# Altium project СТЖ-1-ПУ-01-00-001 - Плата системы управления.PrjPcb
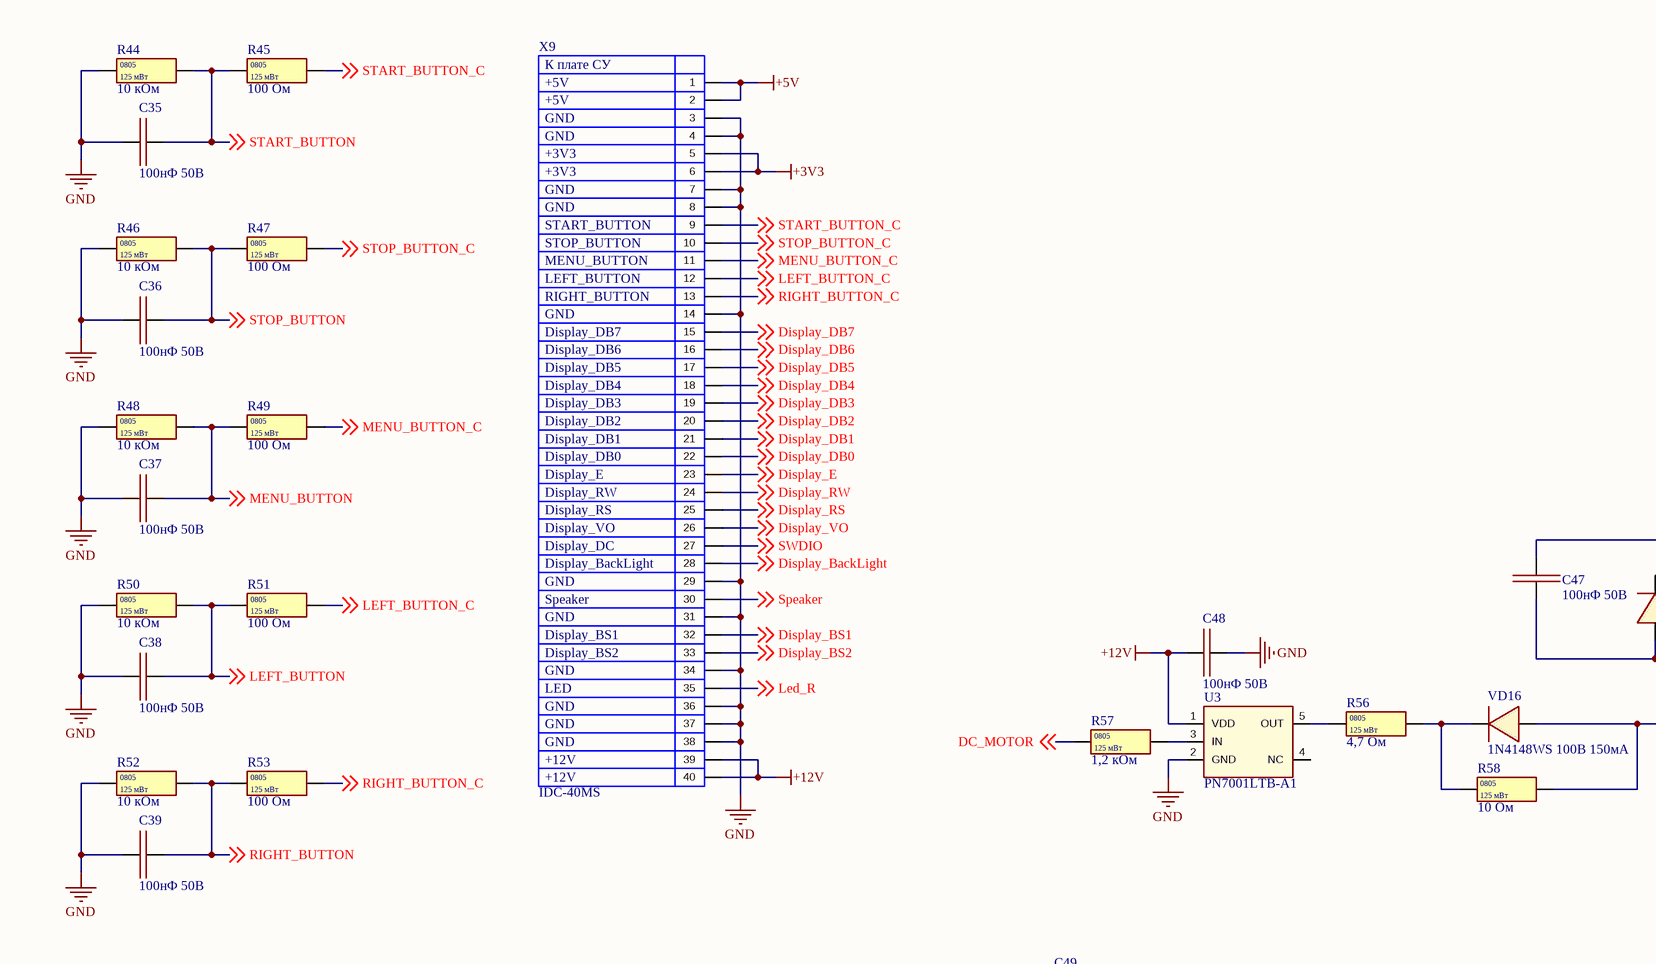
[diagram p0: СТЖ-1-ПУ-01-00-001.SchDoc, top left]
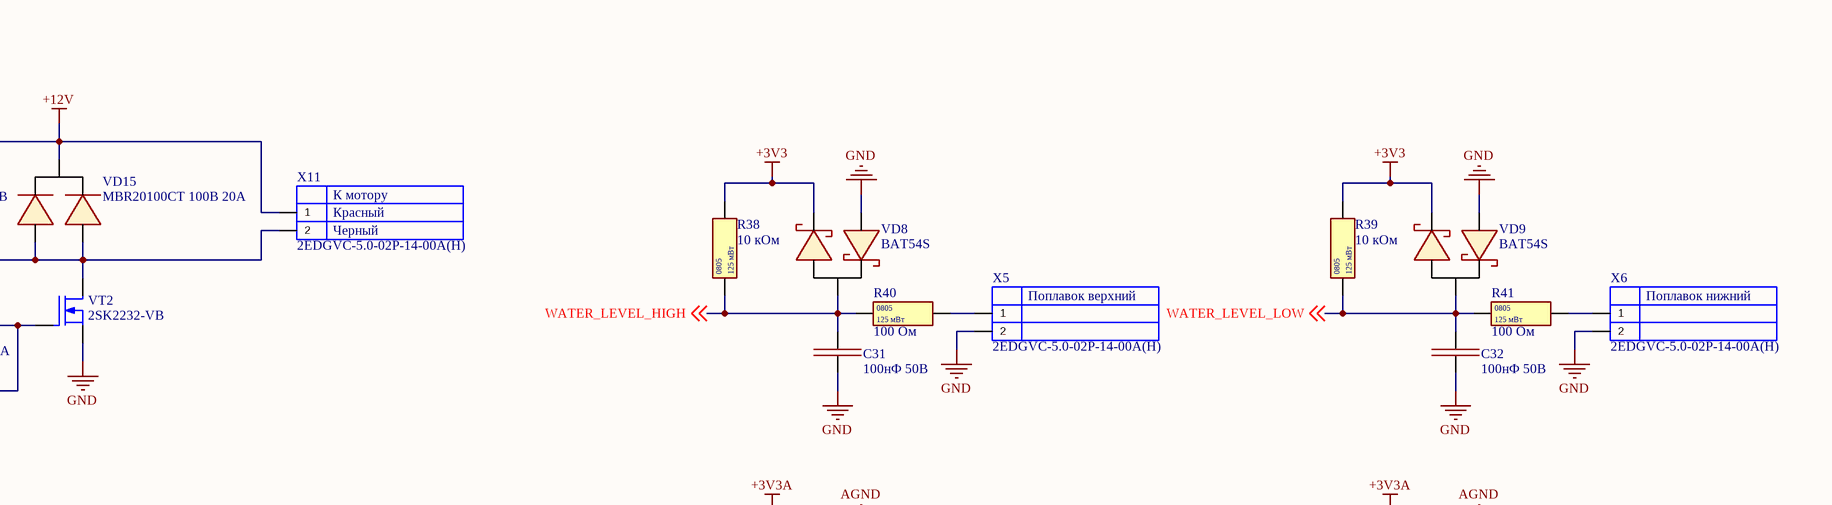
[diagram p1: СТЖ-1-ПУ-01-00-001.SchDoc, top right]
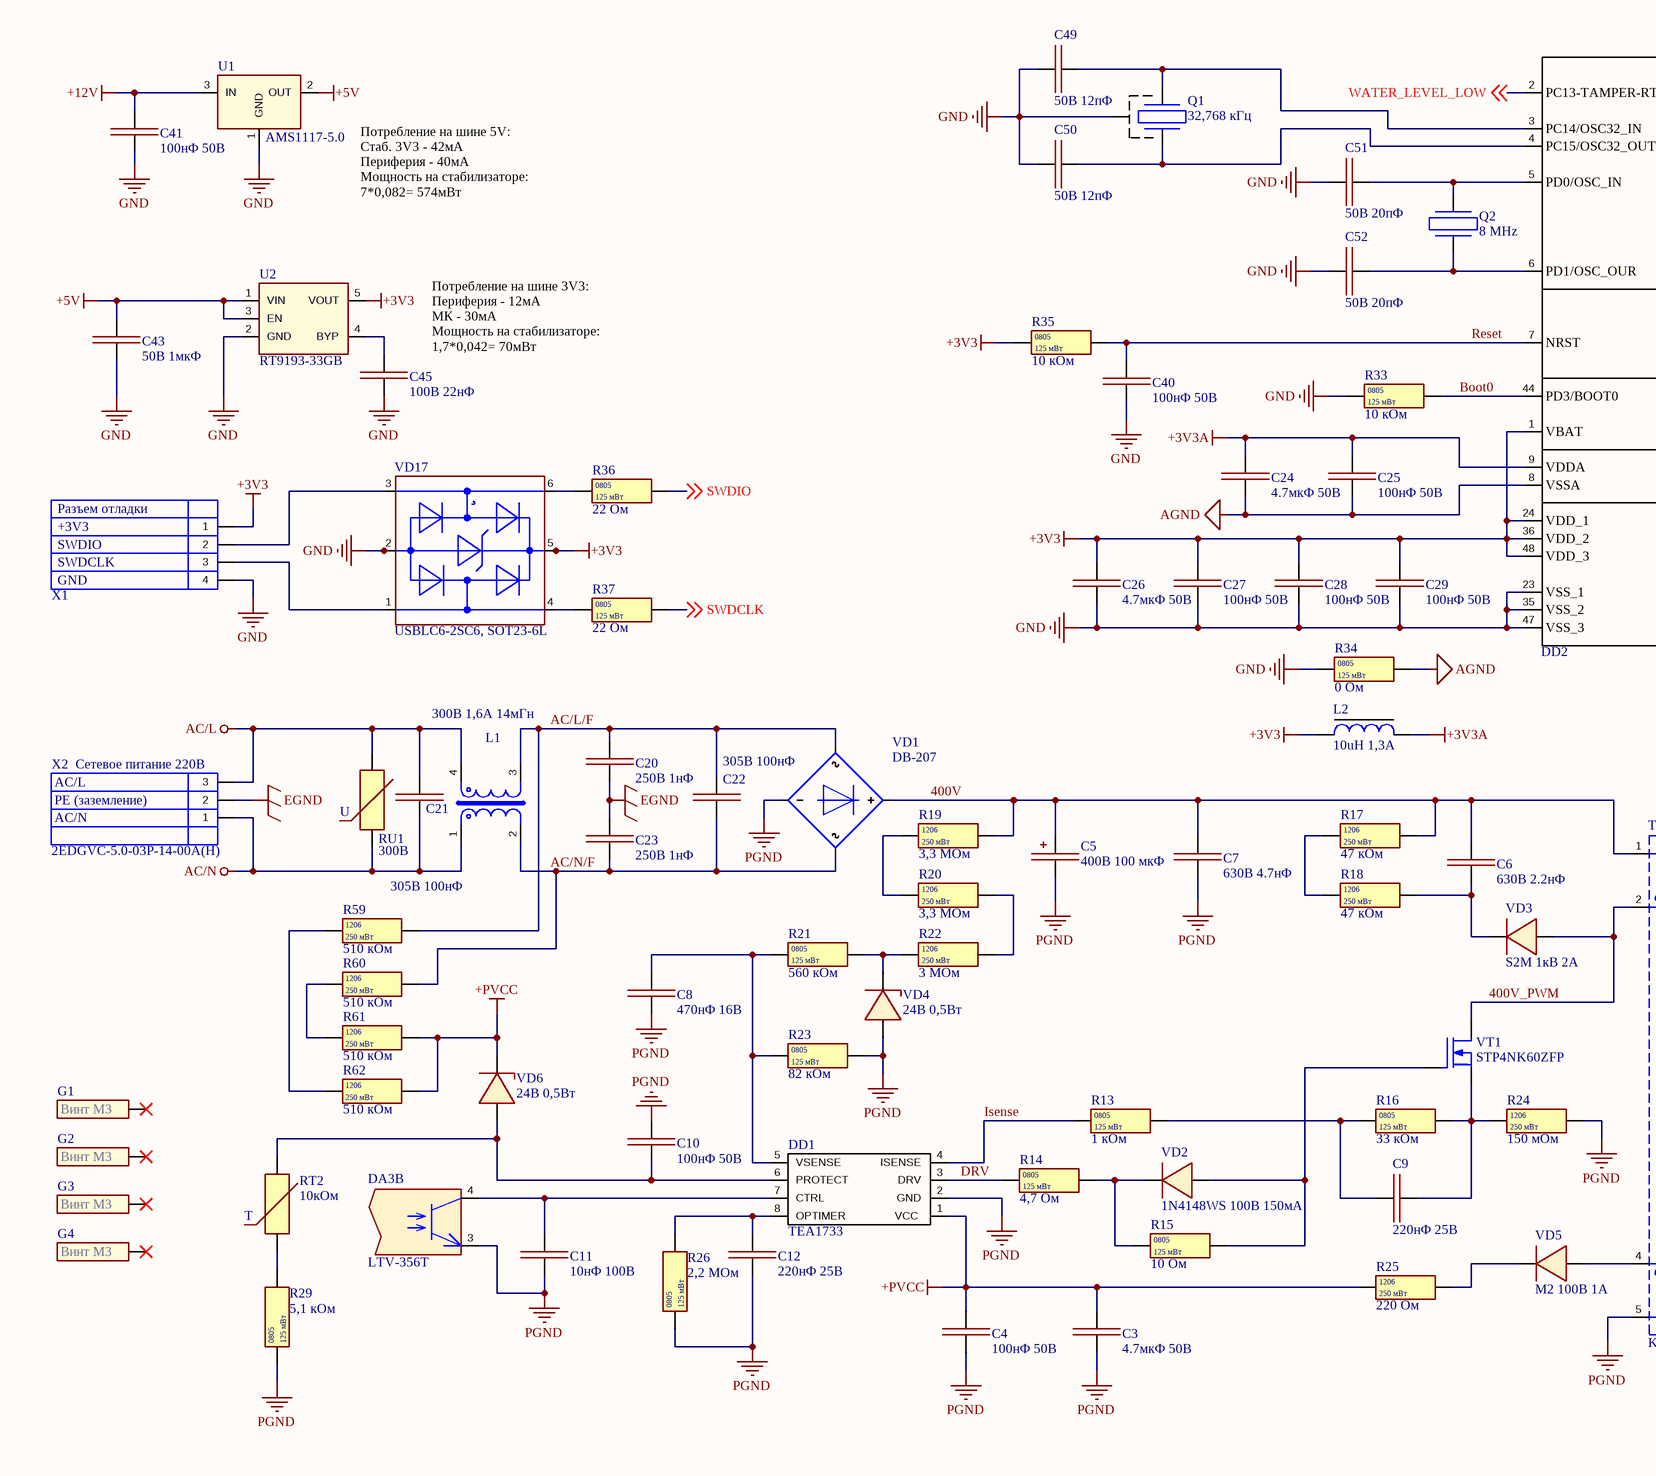
[diagram p2: СТЖ-1-ПУ-01-00-001.SchDoc, bottom left]
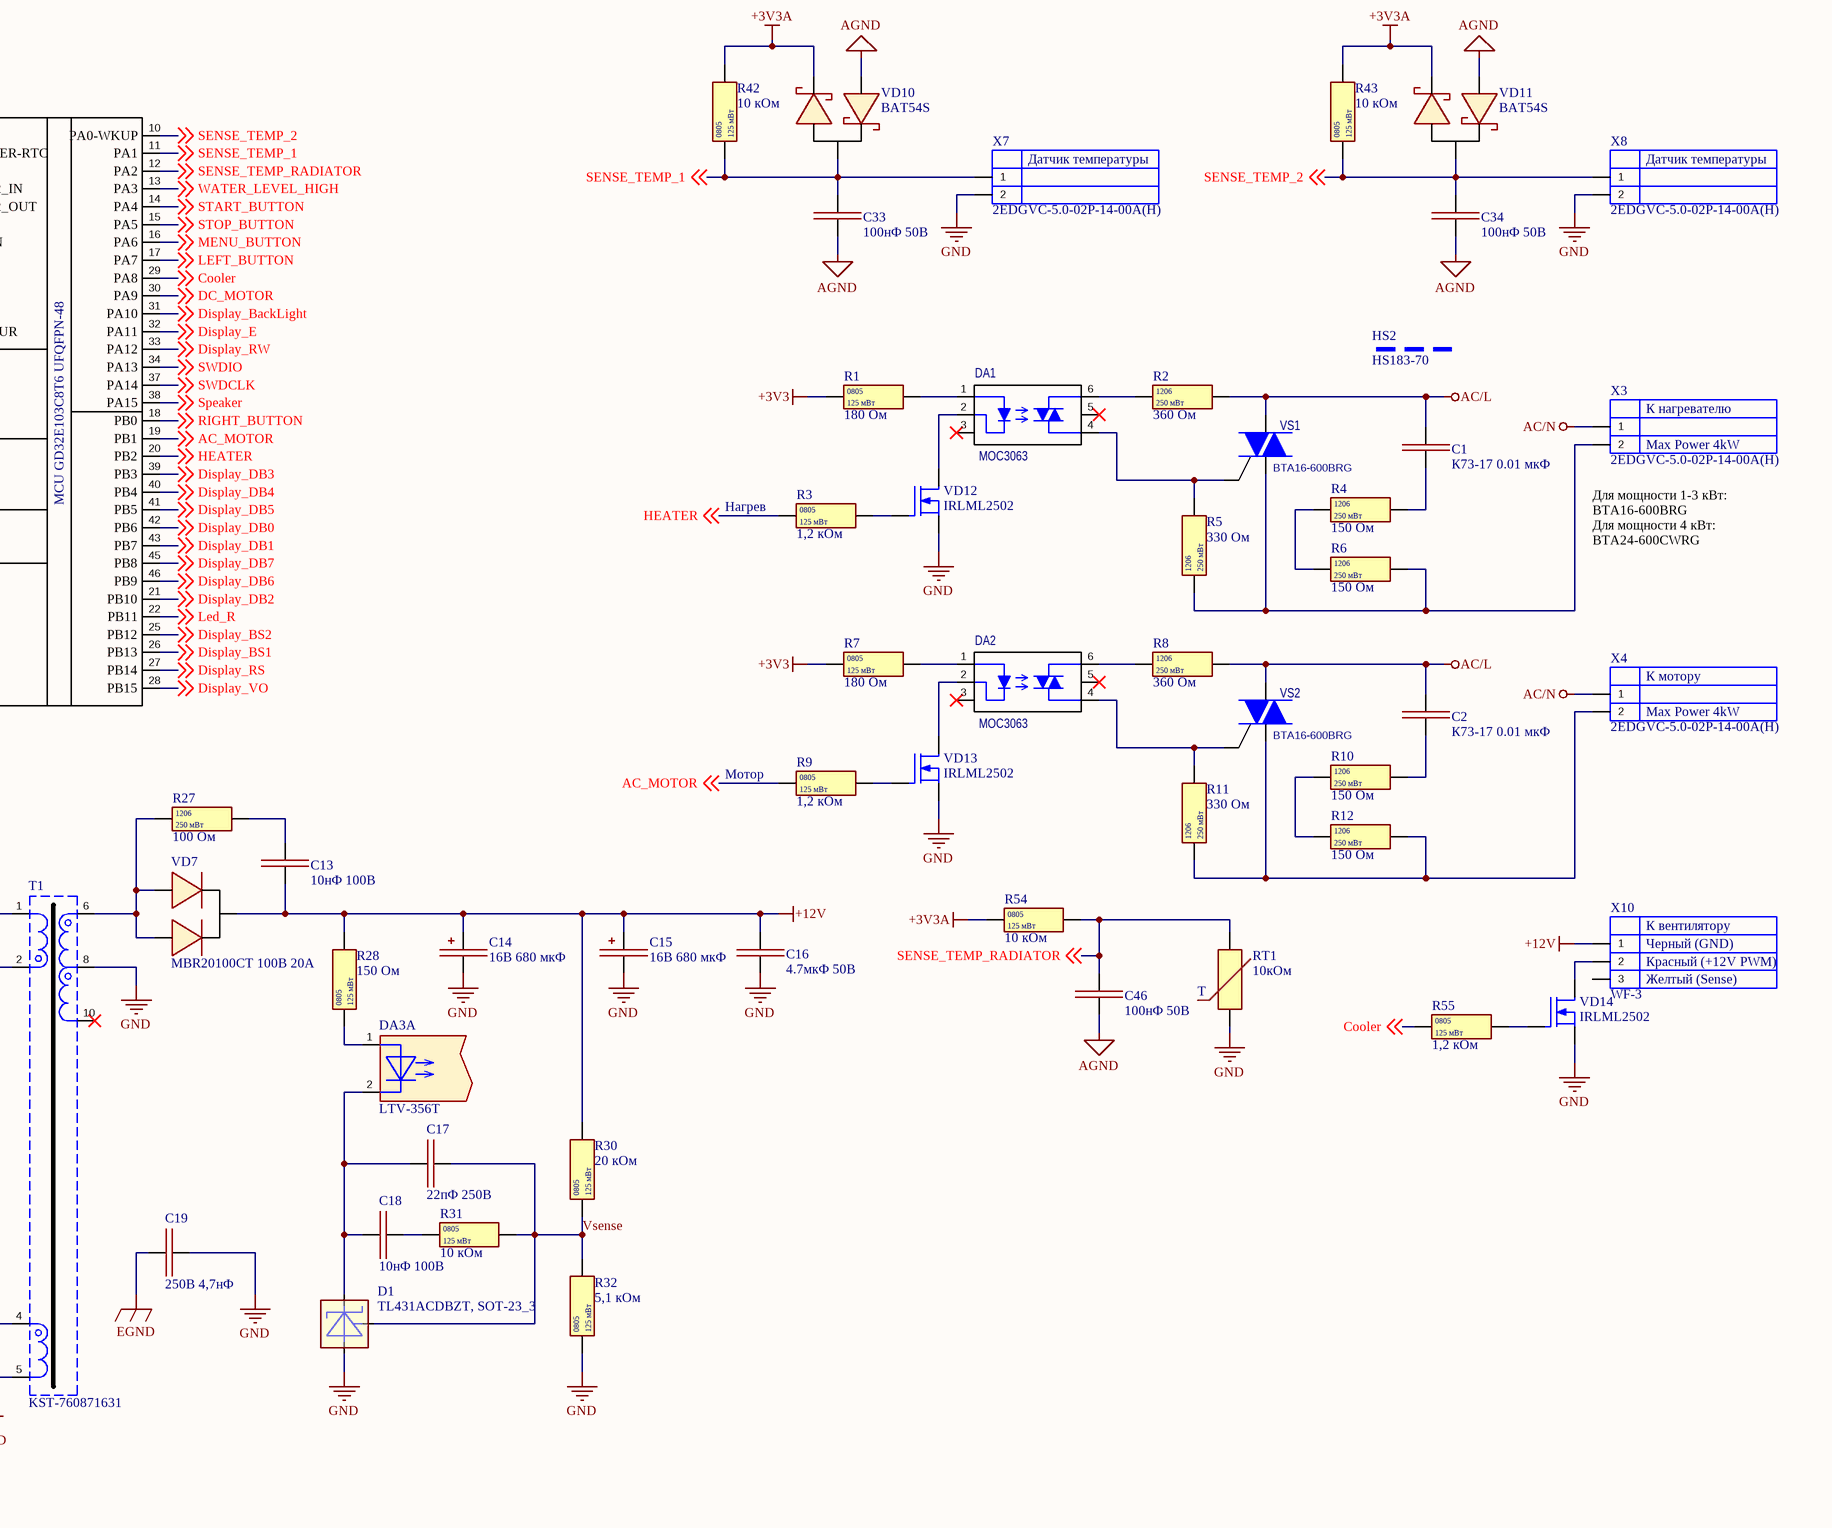
[diagram p3: СТЖ-1-ПУ-01-00-001.SchDoc, bottom right]
1 sheet, 165 parts. Net scope: global (net labels, ports and power ports of the same name join across sheets).
Board file: СТЖ-1-ПП-01-00-001.PcbDoc

## Sheet СТЖ-1-ПУ-01-00-001.SchDoc
size 594 x 420 mm; Date: 01.23; CheckedBy: Козуто; Author: Большаков; PageSetup: Record=PageOptions|CenterHorizontal=True|CenterVertical=True|PrintScale=0.94|XCorrection=1.00|YCorrection=1.00|PrintKind=1|BorderSize=5000000|LeftOffset=0|BottomOffset=0|Orientation=1|PaperLength=1000|PaperWidth=1000|Scale=100|PaperSource=7|PrintQuality=-4|MediaType=1|DitherType=10|PaperKind=A4|PrintScaleMode=1; DecimalNumber: СТЖ-1.ПУ.01.00.001; MainDevice: Перв.примен.; Name: Система управления

### Parts
C1  К73-17 0.01 мкФ  [K73_17_400V]
C2  К73-17 0.01 мкФ  [K73_17_400V]
C3  4.7мкФ 50В  [C-1206]
C4  100нФ 50В  [C-0805]
C5  400В 100 мкФ  [JNE_22x25]
C6  630В 2.2нФ  [C-1206]
C7  630В 4.7нФ  [C-1206]
C8  470нФ 16В  [C-0805]
C9  220нФ 25В  [C-0805]
C10  100нФ 50В  [C-0805]
C11  10нФ 100В  [C-0805]
C12  220нФ 25В  [C-0805]
C13  10нФ 100В  [C-0805]
C14  16В 680 мкФ  [JRC_8x16]
C15  16В 680 мкФ  [JRC_8x16]
C16  4.7мкФ 50В  [C-1206]
C17  22пФ 250В  [C-0805]
C18  10нФ 100В  [C-0805]
C19  250В 4,7нФ  [C_X/Y_10mm]
C20  250В 1нФ  [C_X/Y_10mm]
C21  305В 100нФ  [B32922_5x10.5x18]
C22  305В 100нФ  [B32922_5x10.5x18]
C23  250В 1нФ  [C_X/Y_10mm]
C24  4.7мкФ 50В  [C-1206]
C25  100нФ 50В  [C-0805]
C26  4.7мкФ 50В  [C-1206]
C27  100нФ 50В  [C-0805]
C28  100нФ 50В  [C-0805]
C29  100нФ 50В  [C-0805]
C31  100нФ 50В  [C-0805]
C32  100нФ 50В  [C-0805]
C33  100нФ 50В  [C-0805]
C34  100нФ 50В  [C-0805]
C35  100нФ 50В  [C-0805]
C36  100нФ 50В  [C-0805]
C37  100нФ 50В  [C-0805]
C38  100нФ 50В  [C-0805]
C39  100нФ 50В  [C-0805]
C40  100нФ 50В  [C-0805]
C41  100нФ 50В  [C-0805]
C43  50В 1мкФ  [C-0805-1.25h]
C45  100В 22нФ  [C-0805-1.25h]
C46  100нФ 50В  [C-0805]
C47  100нФ 50В  [C-0805]
C48  100нФ 50В  [C-0805]
C49  50В 12пФ  [C-0603-0.9h]
C50  50В 12пФ  [C-0603-0.9h]
C51  50В 20пФ  [C-0805-1.25h]
C52  50В 20пФ  [C-0805-1.25h]
D1  TL431ACDBZT, SOT-23_3  [SOT-23_BEC]
DA1  MOC3063  [DIP6]
DA2  MOC3063  [DIP6]
DA3  LTV-356T  [PC817 - DIP4]  (parts A,B of 2)
DD1  TEA1733  [SOIC-8]
DD2  MCU GD32E103C8T6 UFQFPN-48  [LQFP48]  (value not drawn)
G1  Винт М3  [Standoff M3]  (value not drawn)  (no BOM)
G2  Винт М3  [Standoff M3]  (value not drawn)  (no BOM)
G3  Винт М3  [Standoff M3]  (value not drawn)  (no BOM)
G4  Винт М3  [Standoff M3]  (value not drawn)  (no BOM)
HS2  HS183-70  [HS183-70]
L1  300В 1,6А 14мГн  [MURATA_PLY_STANDART]
L2  10uH 1,3A  [CD54]
Q1  32,768 кГц  [DT-26]
Q2  8 MHz  [HC-49U]
R1  180 Ом  [R-0805]
R2  360 Ом  [R-1206]
R3  1,2 кОм  [R-0805]
R4  150 Ом  [R-1206]
R5  330 Ом  [R-1206]
R6  150 Ом  [R-1206]
R7  180 Ом  [R-0805]
R8  360 Ом  [R-1206]
R9  1,2 кОм  [R-0805]
R10  150 Ом  [R-1206]
R11  330 Ом  [R-1206]
R12  150 Ом  [R-1206]
R13  1 кОм  [R-0805]
R14  4,7 Ом  [R-0805]
R15  10 Ом  [R-0805]
R16  33 кОм  [R-0805]
R17  47 кОм  [R-1206]
R18  47 кОм  [R-1206]
R19  3,3 МОм  [R-1206]
R20  3,3 МОм  [R-1206]
R21  560 кОм  [R-0805]
R22  3 МОм  [R-1206]
R23  82 кОм  [R-0805]
R24  150 мОм  [R-1206]
R25  220 Ом  [R-1206]
R26  2,2 МОм  [R-0805]
R27  100 Ом  [R-1206]
R28  150 Ом  [R-0805]
R29  5,1 кОм  [R-0805]
R30  20 кОм  [R-0805]
R31  10 кОм  [R-0805]
R32  5,1 кОм  [R-0805]
R33  10 кОм  [R-0805]
R34  0 Ом  [R-0805]
R35  10 кОм  [R-0805]
R36  22 Ом  [R-0805]
R37  22 Ом  [R-0805]
R38  10 кОм  [R-0805]
R39  10 кОм  [R-0805]
R40  100 Ом  [R-0805]
R41  100 Ом  [R-0805]
R42  10 кОм  [R-0805]
R43  10 кОм  [R-0805]
R44  10 кОм  [R-0805]
R45  100 Ом  [R-0805]
R46  10 кОм  [R-0805]
R47  100 Ом  [R-0805]
R48  10 кОм  [R-0805]
R49  100 Ом  [R-0805]
R50  10 кОм  [R-0805]
R51  100 Ом  [R-0805]
R52  10 кОм  [R-0805]
R53  100 Ом  [R-0805]
R54  10 кОм  [R-0805]
R55  1,2 кОм  [R-0805]
R56  4,7 Ом  [R-0805]
R57  1,2 кОм  [R-0805]
R58  10 Ом  [R-0805]
R59  510 кОм  [R-1206]
R60  510 кОм  [R-1206]
R61  510 кОм  [R-1206]
R62  510 кОм  [R-1206]
RT1  10кОм  [Термистор 10k]
RT2  10кОм  [Термистор 10k]
RU1  300В  [U_7,5mm]
T1  KST-760871631  [KST-760871631]
U1  AMS1117-5.0  [SOT-223]
U2  RT9193-33GB  [SOT23-5]
U3  PN7001LTB-A1  [SOT23-5]
VD1  DB-207  [DF-M]
VD2  1N4148WS 100В 150мА  [SOD-323]
VD3  S2M 1кВ 2А  [SMB_2]
VD4  24В 0,5Вт  [MINIMELF]
VD5  M2 100В 1А  [SMA]
VD6  24В 0,5Вт  [MINIMELF]
VD7  MBR20100CT 100В 20А  [TO220-3 bent]
VD8  BAT54S  [SOT-23-3]
VD9  BAT54S  [SOT-23-3]
VD10  BAT54S  [SOT-23-3]
VD11  BAT54S  [SOT-23-3]
VD12  IRLML2502  [SOT-23]
VD13  IRLML2502  [SOT-23]
VD14  IRLML2502  [SOT-23]
VD15  MBR20100CT 100В 20А  [TO220-3 bent]
VD16  1N4148WS 100В 150мА  [SOD-323]
VD17  USBLC6-2SC6, SOT23-6L  [SOT23-6L]
VS1  BTA16-600BRG  [TO220-3 bent]
VS2  BTA16-600BRG  [TO220-3 bent]
VT1  STP4NK60ZFP  [TO-220FP]
VT2  2SK2232-VB  [TO-220FP]
X1  PLS-4  [PLS 2.54-4]  (value not drawn)
X2  2EDGVC-5.0-03P-14-00A(H)  [2EDGVC-5.0-03P-14-00AH]
X3  2EDGVC-5.0-02P-14-00A(H)  [2EDGVC-5.0-02P-14-00AH]
X4  2EDGVC-5.0-02P-14-00A(H)  [2EDGVC-5.0-02P-14-00AH]
X5  2EDGVC-5.0-02P-14-00A(H)  [2EDGVC-5.0-02P-14-00AH]
X6  2EDGVC-5.0-02P-14-00A(H)  [2EDGVC-5.0-02P-14-00AH]
X7  2EDGVC-5.0-02P-14-00A(H)  [2EDGVC-5.0-02P-14-00AH]
X8  2EDGVC-5.0-02P-14-00A(H)  [2EDGVC-5.0-02P-14-00AH]
X9  IDC-40MS  [PLS-2x40]
X10  WF-3  [WF-3]
X11  2EDGVC-5.0-02P-14-00A(H)  [2EDGVC-5.0-02P-14-00AH]

### Nets
+3V3: C26.2 C27.2 C28.2 C29.2 DD2.1(VBAT) DD2.24(VDD_1) DD2.36(VDD_2) DD2.48(VDD_3) L2.1 R1.1 R7.1 R35.1 R38.2 R39.2 U2.5(VOUT) VD8.3 VD9.3 VD17.5 X1.1 X9.5 X9.6
+3V3A: C24.2 C25.2 DD2.9(VDDA) L2.2 R42.2 R43.2 R54.1 VD10.3 VD11.3
+5V: C43.2 U1.2(OUT) U2.1(VIN) U2.3(EN) X9.1 X9.2
+12V: C13.1 C14.2 C15.2 C16.2 C41.2 C47.2 C48.2 R28.2 R30.2 U1.3(IN) U3.1(VDD) VD7.2 VD15.2 X9.39 X9.40 X10.1 X11.1
+PVCC: C3.2 C4.2 DD1.1(VCC) R25.1 R61.2 R62.2 VD6.2(1.27)
AC/L: C1.2 C2.2 C21.2 L1.4 R2.2 R8.2 RU1.1 VS1.2(A2) VS2.2(A2) X2.3
AC/N: C21.1 L1.1 RU1.2 X2.1 X3.1 X4.1
AGND: C24.1 C25.1 C33.1 C34.1 C46.1 DD2.8(VSSA) R34.2 VD10.1 VD11.1
EGND: C19.2 C20.1 C23.2 X2.2
GND: C14.1 C15.1 C16.1 C19.1 C26.1 C27.1 C28.1 C29.1 C31.1 C32.1 C35.2 C36.2 C37.2 C38.2 C39.2 C40.2 C41.1 C43.1 C45.1 C48.1 C49.2 C50.2 C51.2 C52.2 D1.3(Collector) DD2.23(VSS_1) DD2.35(VSS_2) DD2.47(VSS_3) Q1.3 R32.1 R33.1 R34.1 R44.1 R46.1 R48.1 R50.1 R52.1 RT1.2 T1.8 U1.1(GND) U2.2(GND) U3.2(GND) VD8.1 VD9.1 VD12.2(S) VD13.2(S) VD14.2(S) VD17.2 VT2.2(S) X1.4 X5.2 X6.2 X7.2 X8.2 X9.3 X9.4 X9.7 X9.8 X9.14 X9.29 X9.31 X9.34 X9.36 X9.37 X9.38
PGND: C3.1 C4.1 C5.2 C7.1 C8.1 C10.2 C11.1 C12.1 DA3.3 DD1.2(GND) R23.2 R24.2 R26.1 R29.1 T1.5 VD1.2 VD4.1
400V: C5.1 C6.2 C7.2 R17.2 R19.2 T1.1 VD1.1
400V_PWM: T1.2 VD3.1 VT1.3(D)
AC/L/F: C20.2 C22.2 L1.3 R59.2 VD1.4
AC/N/F: C22.1 C23.1 L1.2 R60.2 VD1.3
AC_MOTOR: DD2.19(PB1) R9.1 ; off-sheet AC_MOTOR
Boot0: DD2.44(PD3/BOOT0) R33.2
Cooler: DD2.29(PA8) R55.1 ; off-sheet Cooler
DC_MOTOR: DD2.30(PA9) R57.1 ; off-sheet DC_MOTOR
Display_BackLight: DD2.31(PA10) X9.28 ; off-sheet Display_BackLight
Display_BS1: DD2.26(PB13) X9.32 ; off-sheet Display_BS1
Display_BS2: DD2.25(PB12) X9.33 ; off-sheet Display_BS2
Display_DB0: DD2.42(PB6) X9.22 ; off-sheet Display_DB0
Display_DB1: DD2.43(PB7) X9.21 ; off-sheet Display_DB1
Display_DB2: DD2.21(PB10) X9.20 ; off-sheet Display_DB2
Display_DB3: DD2.39(PB3) X9.19 ; off-sheet Display_DB3
Display_DB4: DD2.40(PB4) X9.18 ; off-sheet Display_DB4
Display_DB5: DD2.41(PB5) X9.17 ; off-sheet Display_DB5
Display_DB6: DD2.46(PB9) X9.16 ; off-sheet Display_DB6
Display_DB7: DD2.45(PB8) X9.15 ; off-sheet Display_DB7
Display_E: DD2.32(PA11) X9.23 ; off-sheet Display_E
Display_RS: DD2.27(PB14) X9.25 ; off-sheet Display_RS
Display_RW: DD2.33(PA12) X9.24 ; off-sheet Display_RW
Display_VO: DD2.28(PB15) X9.26 ; off-sheet Display_VO
DRV: DD1.3(DRV) R14.1
HEATER: DD2.20(PB2) R3.1 ; off-sheet HEATER
Isense: DD1.4(ISENSE) R13.1
Led_R: DD2.22(PB11) X9.35 ; off-sheet Led_R
LEFT_BUTTON: C38.1 DD2.17(PA7) R50.2 R51.1 ; off-sheet LEFT_BUTTON
LEFT_BUTTON_C: R51.2 X9.12 ; off-sheet LEFT_BUTTON_C
MENU_BUTTON: C37.1 DD2.16(PA6) R48.2 R49.1 ; off-sheet MENU_BUTTON
MENU_BUTTON_C: R49.2 X9.11 ; off-sheet MENU_BUTTON_C
Reset: C40.1 DD2.7(NRST) R35.2
RIGHT_BUTTON: C39.1 DD2.18(PB0) R52.2 R53.1 ; off-sheet RIGHT_BUTTON
RIGHT_BUTTON_C: R53.2 X9.13 ; off-sheet RIGHT_BUTTON_C
SENSE_TEMP_1: C33.2 DD2.11(PA1) R42.1 VD10.2 X7.1 ; off-sheet SENSE_TEMP_1
SENSE_TEMP_2: C34.2 DD2.10(PA0-WKUP) R43.1 VD11.2 X8.1 ; off-sheet SENSE_TEMP_2
SENSE_TEMP_RADIATOR: C46.2 DD2.12(PA2) R54.2 RT1.1 ; off-sheet SENSE_TEMP_RADIATOR
Speaker: DD2.38(PA15) X9.30 ; off-sheet Speaker
START_BUTTON: C35.1 DD2.14(PA4) R44.2 R45.1 ; off-sheet START_BUTTON
START_BUTTON_C: R45.2 X9.9 ; off-sheet START_BUTTON_C
STOP_BUTTON: C36.1 DD2.15(PA5) R46.2 R47.1 ; off-sheet STOP_BUTTON
STOP_BUTTON_C: R47.2 X9.10 ; off-sheet STOP_BUTTON_C
SWDCLK: DD2.37(PA14) R37.2 ; off-sheet SWDCLK
SWDIO: DD2.34(PA13) R36.2 X9.27 ; off-sheet SWDIO
Vsense: C17.1 D1.2(Emitter) R30.1 R31.2 R32.2
WATER_LEVEL_HIGH: C31.2 DD2.13(PA3) R38.1 R40.1 VD8.2 ; off-sheet WATER_LEVEL_HIGH
WATER_LEVEL_LOW: C32.2 DD2.2(PC13-TAMPER-RTC) R39.1 R41.1 VD9.2 ; off-sheet WATER_LEVEL_LOW
NetC1_1: C1.1 R4.2
NetC2_1: C2.1 R10.2
NetC6_1: C6.1 R18.2 VD3.2(1.27)
NetC8_2: C8.2 DD1.5(VSENSE) R21.1 R23.1
NetC9_1: C9.1 R16.2 R24.1 VT1.2(S)
NetC9_2: C9.2 R13.2 R16.1
NetC10_1: C10.1 DD1.6(PROTECT) RT2.1 VD6.1
NetC11_2: C11.2 DA3.4 DD1.7(CTRL)
NetC12_2: C12.2 DD1.8(OPTIMER) R26.2
NetC13_2: C13.2 R27.2
NetC17_2: C17.2 C18.2 D1.1(Base) DA3.2
NetC18_1: C18.1 R31.1
NetC45_2: C45.2 U2.4(BYP)
NetC47_1: C47.1 VD15.1 VD15.3 VT2.3(D) X11.2
NetC49_1: C49.1 DD2.3(PC14/OSC32_IN) Q1.2
NetC50_1: C50.1 DD2.4(PC15/OSC32_OUT) Q1.1
NetC51_1: C51.1 DD2.5(PD0/OSC_IN) Q2.1
NetC52_1: C52.1 DD2.6(PD1/OSC_OUR) Q2.2
NetDA1_1: DA1.1(LED_A) R1.2
NetDA1_2: DA1.2(LED_C) VD12.3(D)
NetDA1_4: DA1.4(Uout) R5.2 VS1.3(G)
NetDA1_6: DA1.6(Uout) R2.1
NetDA2_1: DA2.1(LED_A) R7.2
NetDA2_2: DA2.2(LED_C) VD13.3(D)
NetDA2_4: DA2.4(Uout) R11.2 VS2.3(G)
NetDA2_6: DA2.6(Uout) R8.1
NetDA3_1: DA3.1 R28.1
NetR3_2: R3.2 VD12.1(G)
NetR4_1: R4.1 R6.1
NetR5_1: R5.1 R6.2 VS1.1(A1) X3.2
NetR9_2: R9.2 VD13.1(G)
NetR10_1: R10.1 R12.1
NetR11_1: R11.1 R12.2 VS2.1(A1) X4.2
NetR14_2: R14.2 R15.1 VD2.2(1.27)
NetR15_2: R15.2 VD2.1 VT1.1(G)
NetR17_1: R17.1 R18.1
NetR19_1: R19.1 R20.1
NetR20_2: R20.2 R22.2
NetR21_2: R21.2 R22.1 VD4.2(1.27)
NetR25_2: R25.2 VD5.2(1.27)
NetR27_1: R27.1 T1.6 VD7.1 VD7.3
NetR29_2: R29.2 RT2.2
NetR36_1: R36.1 VD17.6
NetR37_1: R37.1 VD17.4
NetR40_2: R40.2 X5.1
NetR41_2: R41.2 X6.1
NetR55_2: R55.2 VD14.1(G)
NetR56_1: R56.1 U3.5(OUT)
NetR56_2: R56.2 R58.1 VD16.2(1.27)
NetR57_2: R57.2 U3.3(IN)
NetR58_2: R58.2 VD16.1 VT2.1(G)
NetR59_1: R59.1 R62.1
NetR60_1: R60.1 R61.1
NetT1_4: T1.4 VD5.1
NetVD14_3: VD14.3(D) X10.2
NetVD17_1: VD17.1 X1.3
NetVD17_3: VD17.3 X1.2

Not connected (* = marked no-connect by the designer): DA1 3(NC)* 5(NC)*; DA2 3(NC)* 5(NC)*; G1 G*; G2 G*; G3 G*; G4 G*; T1 10*; U3 4(NC); X10 3

### Notes on the sheet
- К плате СУ
- +5V
- GND
- +3V3
- START_BUTTON
- STOP_BUTTON
- MENU_BUTTON
- LEFT_BUTTON
- RIGHT_BUTTON
- Display_DB4
- Display_DB5
- Display_DB6
- Display_DB7
- Display_E
- Display_DB0
- Display_DB1
- Display_DB2
- Display_DB3
- Display_VO
- Display_RS
- Display_RW
- Display_DС
- (near X9) Display_BackLight
- Speaker
- (near X11) К мотору
- (near X11) Красный
- Display_BS1
- Display_BS2
- LED
- (near X11) Черный
- (near X5) Поплавок верхний
- (near X6) Поплавок нижний
- +12V
- (near X7) Датчик температуры
- (near X8) Датчик температуры
- (near U1) Потребление на шине 5V:
  Стаб. 3V3 - 42мА
  Периферия - 40мА
  Мощность на стабилизаторе:
  7*0,082= 574мВт
- (near C45) Потребление на шине 3V3:
  Периферия - 12мА
  МК - 30мА
  Мощность на стабилизаторе:
  1,7*0,042= 70мВт
- (near X3) К нагревателю
- (near X3) Max Power 4kW
- Разъем отладки
- (near R3) Нагрев
- (near X3) Для мощности 1-3 кВт:
  BTA16-600BRG
  Для мощности 4 кВт:
  BTA24-600CWRG
- SWDIO
- SWDCLK
- (near X4) К мотору
- (near X4) Max Power 4kW
- (near R9) Мотор
- AC/L
- PE (заземление)
- AC/N
- (near X2) Сетевое питание 220В
- (near X10) К вентилятору
- (near X10) Красный (+12V PWM)
- (near X10) Черный (GND)
- (near X10) Желтый (Sense)
- Перв.примен.
- Справ.№
- Подп. и дата
- Инв.№ дубл.
- Взам.инв.№
- Подп.и дата
- Разраб.
- Изм.
- Лист
- № докум.
- Подп.
- Дата
- Лит.
- Масштаб
- Масса
- Т.контр.
- Пров.
- СХЕМА   ЭЛЕКТРИЧЕСКАЯ
- ПРИНЦИПИАЛЬНАЯ
- Листов
- Инв.№ подл.
- Утв.
- Н.контр.
- Нач.сект.
- Формат  A2
- (in symbol B57861-S 103-F40) T
- (in symbol B72214S0301K101) U
- (in symbol ERJ8BSFR15V) 1206; 250 мВт
- (in symbol RC0805FR-075K1L) 0805; 125 мВт
- (in symbol RC0805FR-0720KL) 0805; 125 мВт
- (in symbol RC0805JR-070RL) 0805; 125 мВт
- (in symbol RC0805JR-071K2L) 0805; 125 мВт
- (in symbol RC0805JR-071KL) 0805; 125 мВт
- (in symbol RC0805JR-072M2L) 0805; 125 мВт
- (in symbol RC0805JR-074R7L) 0805; 125 мВт
- (in symbol RC0805JR-075K1L) 0805; 125 мВт
- (in symbol RC0805JR-0710KL) 0805; 125 мВт
- (in symbol RC0805JR-0710RL) 0805; 125 мВт
- (in symbol RC0805JR-0722RL) 0805; 125 мВт
- (in symbol RC0805JR-0733KL) 0805; 125 мВт
- (in symbol RC0805JR-0782KL) 0805; 125 мВт
- (in symbol RC0805JR-07100RL) 0805; 125 мВт
- (in symbol RC0805JR-07150KL) 0805; 125 мВт
- (in symbol RC0805JR-07180RL) 0805; 125 мВт
- (in symbol RC0805JR-07560KL) 0805; 125 мВт
- (in symbol RC1206FR-07220RL) 1206; 250 мВт
- (in symbol RC1206JR-073M3L) 1206; 250 мВт
- (in symbol RC1206JR-073ML) 1206; 250 мВт
- (in symbol RC1206JR-0747КL) 1206; 250 мВт
- (in symbol RC1206JR-07100RL) 1206; 250 мВт
- (in symbol RC1206JR-07150RL) 1206; 250 мВт
- (in symbol RC1206JR-07330RL) 1206; 250 мВт
- (in symbol RC1206JR-07360RL) 1206; 250 мВт
- (in symbol RC1206JR-07510KL) 1206; 250 мВт

### Library data of the parts
C1 C2 = К73-17 0.01 мкФ - 400 В: Конденсатор К73-17 0.01 мкФ - 400 В - 10%; Value: Конденсатор К73-17 0.01 мкФ - 400 В - 10%
C3 C16 C24 C26 = CC1206KKX7R9BB475: Конденсатор 1206 10% 50В 4.7мкФ X7R; Value: Керамический конденсатор X7R 4.7мкФ ±10% 50В, 1206; Note: Yageo
C4 C10 C25 C27-C29 C31-C41 C46-C48 = GRM21BR71H104KA01L: Конденсатор 0805 10% 50В 100нФ X7R; Value: Керам. ЧИП конд. 0,1 мкФ - 50 В - X7R - 10 % - 0805
C5 = JNE2G101M10002200250: Конденсатор Эл-лит. 20% 400В 100 мкФ; Value: Конденсатор NICHICON GX 390 мкФ - 500 В (35х50)
C6 = GRM31BR72J222KW01L: Конденсатор 1206 10% 630В 2.2нФ X7R; Value: Керамический конденсатор X7R 4.7мкФ ±10% 50В, 1206; Note: Yageo
C7 = GRM31BR72J472KW01L: Конденсатор 1206 10% 630В 4.7нФ X7R; Value: Керамический конденсатор X7R 4.7мкФ ±10% 50В, 1206; Note: Yageo
C8 = GRM219R71C474K: Конденсатор 0805 10% 16В 470нФ X7R; Value: Керам. ЧИП конд. 0,1 мкФ - 50 В - X7R - 10 % - 0805
C9 C12 = GRM219R71E224K: Конденсатор 0805 10% 25В 220нФ X7R; Value: Керам. ЧИП конд. 0,1 мкФ - 50 В - X7R - 10 % - 0805
C11 C13 C18 = GRM21BR72A103KA01L: Конденсатор 0805 10% 100В 10нФ X7R; Value: Керам. ЧИП конд. 0,1 мкФ - 50 В - X7R - 10 % - 0805
C14 C15 = JRC1C681M03500800160000B: Конденсатор Эл-лит. 20% 16В 680 мкФ; Value: Конденсатор NICHICON GX 390 мкФ - 500 В (35х50)
C17 = GRM21A5C2E220J: Конденсатор 0805 10% 250В 22пФ C0G; Value: Керам. ЧИП конд. 0,1 мкФ - 50 В - X7R - 10 % - 0805
C19 = DE1E3KX472MN4AN01F: Конденсатор X1/Y1 20% 250В 4,7нФ; OriginalName: CAP1; ComponentField6: Published 8-Jun-2000
C20 C23 = DE1E3KX102MA4BN01F: Конденсатор X1/Y1 20% 250В 1нФ; OriginalName: CAP1; ComponentField6: Published 8-Jun-2000
C21 C22 = B32922C3104K000: Конденсатор X2 Пропилен 10% 305В 100нФ; OriginalName: CAP1; ComponentField6: Published 8-Jun-2000
C43 = GRM21BR71H105KA12L: Конденсатор 0805 10% 50В 1мкФ X7R; Value: Керам. ЧИП конд. 1 мкФ - 50 В - X7R - 10 % - 0805; Note: MURATA corp.
C45 = GRM21BR72A223KA01L: Конденсатор 0805 10% 100В 22нФ X7R; Value: Керам. ЧИП конд. 0,022 мкФ - 100 В - X7R - 10 % - 0805; Note: MURATA corp.
C49 C50 = CC0603JRNPO9BN120: Конденсатор 0603 05% 50В 12пФ NP0; Value: Керам. ЧИП конд. 12 пФ - 50 В - NPO - 5 % - 0603; Note: YAGEO
C51 C52 = CC0805JRNPO9BN200: Конденсатор 0805 05% 50В 20пФ NP0; Value: Керам. ЧИП конд. 20 пФ - 50 В - NPO - 5 % - 0805; Note: YAGEO corp.
D1 = TL431ACDBZT, SOT-23_3: ИОН TL431ACDBZT, SOT-23_3; Value: Транзистор BC847С, SOT-23; ComponentLink1Description: NEXPERIA; ComponentLink1URL: D:\ММЦМ.303359 - Система разгрузки\#Приложение\BC847_SER.pdf
DA1 DA2 = MOC3063: Оптосимистор MOC3063, DIP6 zero-cross; Value: Оптосимистор MOC3023, DIP6
DA3 = LTV-356T: Оптрон PC817, DIP-4; Value: PC817, DIP-4
DD1 = TEA1733: AC/DC TEA1733, SO8; Note: IR
DD2 = GD32E103C8T6: Микроконтроллер
G1-G4 = Винт М3: Винт М3 DIN 967
HS2 = HS183-70: Радиатор HS183-70; Value: Радиатор HS183-70
L1 = PLY10AN1521R6R2: Фильтр ЭМП 300В 1,6А 14мГн; Value: Дроссель двухобмоточный 2x1,5 мГн - 1,6 А - 300 В; Note: MURATA corp.
L2 = CD54-100K: Дроссель 10% 10uH 1,3A
Q1 = DT-26: Кварцевый резонатор 32,768 кГц; Note: GEYER Electronic; Value: Кварцевый резонатор KX-7, 32 MHz, SMD
Q2 = L-KLS14-HC-49S-8.000-20-30-A: Кварцевый резонатор 8MHz HC49; Note: GEYER Electronic; Value: Кварцевый резонатор KX-7, 32 MHz, SMD
R1 R7 = RC0805JR-07180RL: Резистор 0805 5% 180 Ом
R2 R8 = RC1206JR-07360RL: Резистор 1206 5% 360 Ом
R3 R9 R55 R57 = RC0805JR-071K2L: Резистор 0805 5% 1,2 кОм; Value: Чип резистор 1,2 кОм - 0,125 Вт - 5 % - 0805; Note: YAGEO
R4 R6 R10 R12 = RC1206JR-07150RL: Резистор 1206 5% 150 Ом
R5 R11 = RC1206JR-07330RL: Резистор 1206 5% 330 Ом
R13 = RC0805JR-071KL: Резистор 0805 5% 1 кОм; Value: Чип резистор 1 кОм - 0,125 Вт - 5 % - 0805
R14 R56 = RC0805JR-074R7L: Резистор 0805 5% 4,7 Ом; Value: Чип резистор 4,7 кОм - 0,125 Вт - 5 % - 0805; Note: YAGEO
R15 R58 = RC0805JR-0710RL: Резистор 0805 5% 10 Ом; Value: Чип резистор 10 Ом - 0,125 Вт - 5% - 0805; Note: YAGEO
R16 = RC0805JR-0733KL: Резистор 0805 5% 33 кОм; Value: Чип резистор 22 кОм - 0,125 Вт - 5% - 0805; Note: YAGEO
R17 R18 = RC1206JR-0747КL: Резистор 1206 5% 47 кОм; Value: Чип резистор 56 Ом - 0,25 Вт - 5% - 1206; Note: YAGEO
R19 R20 = RC1206JR-073M3L: Резистор 1206 5% 3,3 МОм
R21 = RC0805JR-07560KL: Резистор 0805 5% 560 кОм; Value: Чип резистор 360 кОм - 0,125 Вт - 5% - 0805; Note: YAGEO
R22 = RC1206JR-073ML: Резистор 1206 5% 3 МОм
R23 = RC0805JR-0782KL: Резистор 0805 5% 82 кОм; Value: Чип резистор 360 кОм - 0,125 Вт - 5% - 0805; Note: YAGEO
R24 = ERJ8BSFR15V: Резистор 1206 1% 150 мОм импульсный
R25 = RC1206FR-07220RL: Резистор 1206 1% 220 Ом; Value: Чип резистор 220 Ом - 0,25 Вт - 1% - 1206; Note: YAGEO
R26 = RC0805JR-072M2L: Резистор 0805 5% 2,2 МОм; Value: Чип резистор 1,0 МОм - 0,125 Вт - 5 % - 0805; Note: YAGEO
R27 = RC1206JR-07100RL: Резистор 1206 5% 100 Ом; Value: Чип резистор 100 Ом - 0,25 Вт - 5% - 1206; Note: YAGEO
R28 = RC0805JR-07150KL: Резистор 0805 5% 150 Ом; Value: Чип резистор 150 кОм - 0,125 Вт - 5% - 0805; Note: YAGEO
R29 = RC0805JR-075K1L: Резистор 0805 5% 5,1 кОм; Value: Чип резистор 5,1 кОм - 0,125 Вт - 5% - 0805; Note: YAGEO
R30 = RC0805FR-0720KL: Резистор 0805 1% 20 кОм; Value: Чип резистор 22 кОм - 0,125 Вт - 1% - 0805; Note: YAGEO
R31 R33 R35 R38 R39 R42-R44 R46 R48 R50 R52 R54 = RC0805JR-0710KL: Резистор 0805 5% 10 кОм; Value: Резистор, 10 кОм, 603-RC0805JR-0710KL; Note: YAGEO
R32 = RC0805FR-075K1L: Резистор 0805 1% 5,1 кОм; Value: Чип резистор 4,7 кОм - 0,125 Вт - 1% - 0805
R34 = RC0805JR-070RL: Резистор 0805 5% 0 Ом; Value: Чип резистор 0 Ом - 0,125 Вт - 5% - 0805; Note: YAGEO
R36 R37 = RC0805JR-0722RL: Резистор 0805 5% 22 Ом; Value: Чип резистор 22 Ом - 0,125 Вт - 5% - 0805; Note: YAGEO
R40 R41 R45 R47 R49 R51 R53 = RC0805JR-07100RL: Резистор 0805 5% 100 Ом; Value: Чип резистор 100 Ом - 0,125 Вт - 5% - 0805
R59-R62 = RC1206JR-07510KL: Резистор 1206 5% 510 кОм
RT1 RT2 = B57861-S 103-F40: Термистор 1% 10кОм; OriginalName: CAP1; ComponentField6: Published 8-Jun-2000
RU1 = B72214S0301K101: Варистор 10% 300В 300пФ 50А; OriginalName: CAP1; ComponentField6: Published 8-Jun-2000
T1 = KST-760871631: Трансформатор KST-760871631; Value: Трансформатор T50-3-400/700/700
U1 = AMS1117-5.0: Лин. Стаб. 5V 800mA; Value: Диод 6нс 100В 215мА, BAV99.215, SOT-23
U2 = RT9193-33GB: Лин. Стаб. 3.3V 300mA
U3 = PN7001LTB-A1: Драйвер MOSFET 25V 3.5A
VD1 = DB-207: Диодный мост DB-207; Value: Диодный мост DB-207
VD2 VD16 = 1N4148WS: Диод SOD-323 100В 150мА; Value: Диод 1N4148WS, SOD-323
VD3 = S2M: Диод SMA 1кВ 2А; Value: Диод BZG04-15, SMA
VD4 VD6 = BZV55C24: Стабилитрон miniMELF 24В 0,5Вт; Value: Стабилитрон BZV55-C3V3, miniMELF
VD5 = M2: Диод SMA 100В 1А; Value: Диод BZG04-15, SMA
VD7 VD15 = MBR20100CT: Диод TO220 100В 20А
VD8-VD11 = BAT54S: Диод BAT54S
VD12-VD14 = IRLML2502: Транзистор MOSFET N-Channel 20В 4.2А; Value: DMG1012T-7, MOSFET N-Channel 20V 0.63, SOT-523
VD17 = USBLC6-2SC6, SOT23-6L: Диод USBLC6-2SC6, SOT23-6L; Value: Диод USBLC6-2SC6, SOT23-6L
VS1 VS2 = BTA16-600BRG, TO-220AB: Симистор BTA16-600BRG, TO-220AB; Value: Симистор BTA12-600SWRG TO-220-3
VT1 = STP4NK60ZFP: Транзистор MOSFET N-Ch 600В 4А
VT2 = 2SK2232-VB: Транзистор MOSFET N-Ch 60В 45А
X1 = PLS-4: Разъем PLS-4, шаг 2.54 мм; Value: Вилка на плату PLS-4, шаг 2.54 мм
X2 = 2EDGVC-5.0-03P-14-00A(H): Разъем 2EDGVC-5.0-03P-14-00A(H); Note: DEGSON; Value: Вилка на плату 2EDGR-5.0-03P-14-00A(H)
X3-X8 X11 = 2EDGVC-5.0-02P-14-00A(H): Разъем 2EDGVC-5.0-02P-14-00A(H); Note: DEGSON; Value: Вилка на плату 2EDGR-5.0-02P-14-00A(H)
X9 = BH-40 (DS1013-40S) (IDC-40MS): Разъем шлейф на плату 40 pin шаг 2.54 мм; Value: Вилка на плату PLS-4, шаг 2.54 мм
X10 = WF-3: Разъем WF-3; Value: Вилка на плату WF-3